# Altium schematic sheet MCU.SchDoc
size A4; SheetNumber: 2; SheetTotal: 3
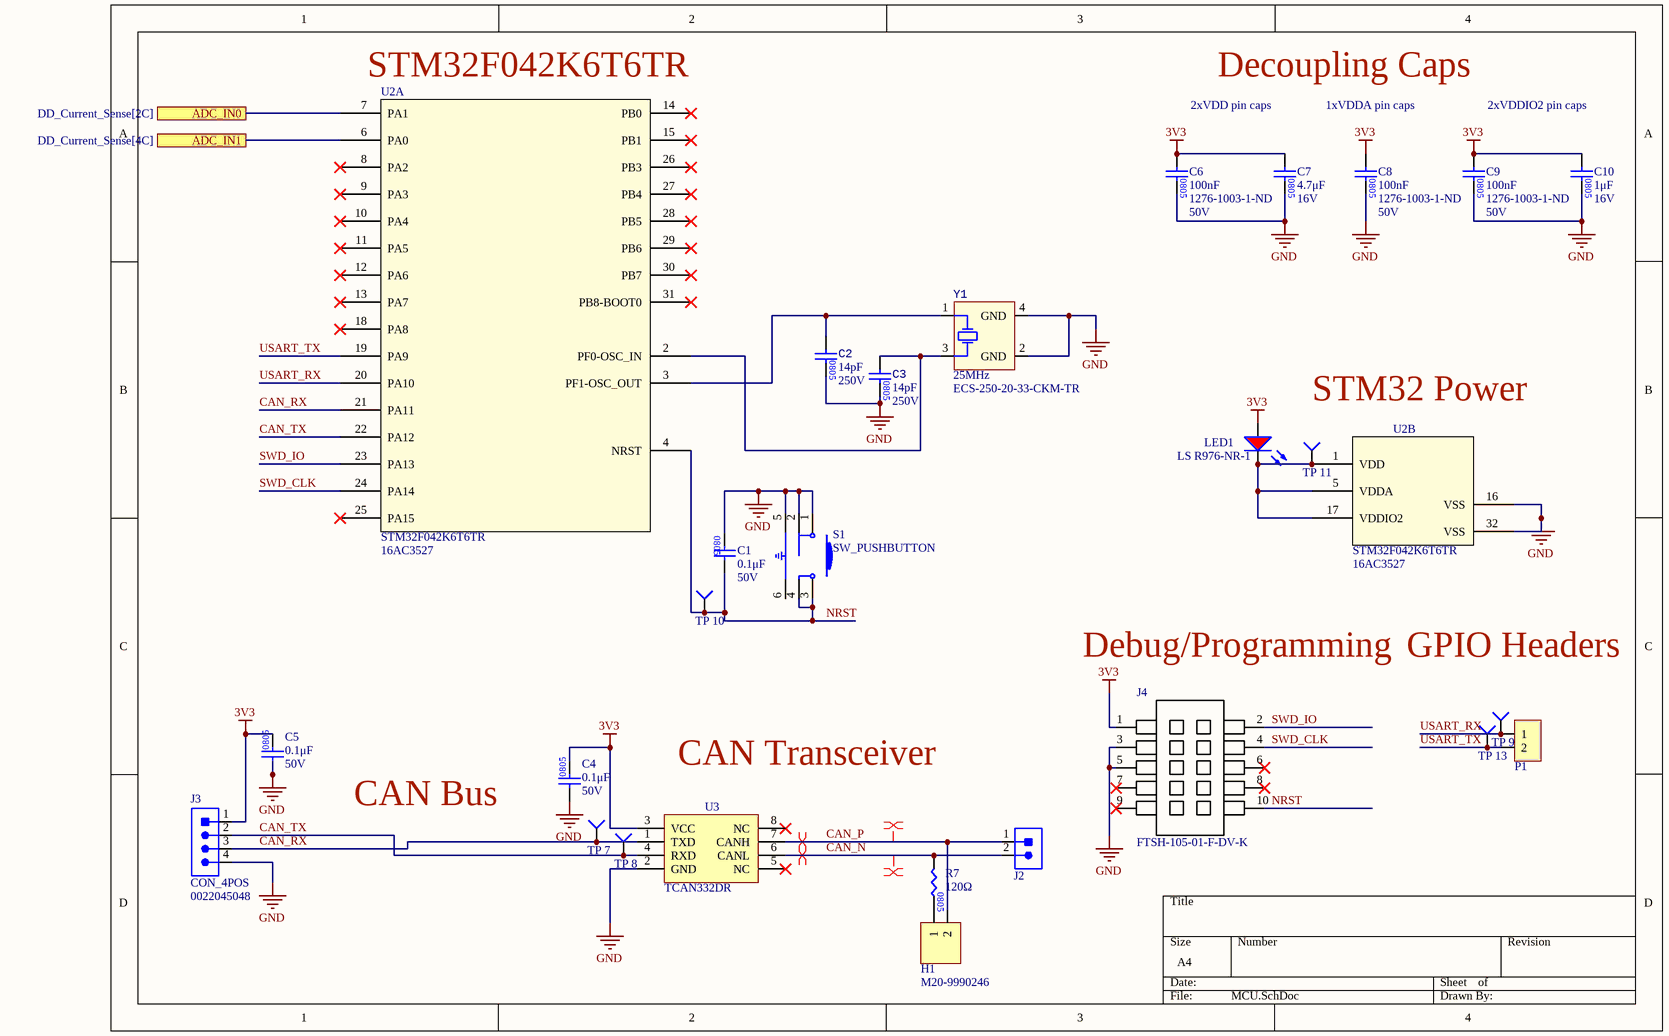
[diagram p0: MCU.SchDoc]

## Parts
C1  value 0.1μF  Voltage Rating: 50V  [CAP2012]  (hidden comment: CAP_0.1uF_50V_0805)
C2  value 14pF  Voltage Rating: 250V  [CAP0805]  (hidden comment: CAP_14pF_50V_0805)
C3  value 14pF  Voltage Rating: 250V  [CAP0805]  (hidden comment: CAP_14pF_50V_0805)
C4  value 0.1μF  Voltage Rating: 50V  [CAP0805]  (hidden comment: CAP_0.1uF_50V_0805)
C5  value 0.1μF  Voltage Rating: 50V  [CAP0805]  (hidden comment: CAP_0.1uF_50V_0805)
C6  value 100nF  Supplier Part Number 1: 1276-1003-1-ND  Voltage Rating: 50V  [CAP0805]  (hidden comment: CAP_100nF_50V_0805)
C7  value 4.7μF  Voltage Rating: 16V  [CAP0805]  (hidden comment: CAP_4.7uF_16V_0805)
C8  value 100nF  Supplier Part Number 1: 1276-1003-1-ND  Voltage Rating: 50V  [CAP0805]  (hidden comment: CAP_100nF_50V_0805)
C9  value 100nF  Supplier Part Number 1: 1276-1003-1-ND  Voltage Rating: 50V  [CAP0805]  (hidden comment: CAP_100nF_50V_0805)
C10  value 1μF  Voltage Rating: 16V  [CAP0805]  (hidden comment: CAP_1uF_16V_0805)
H1  Manufacturer Part Number 1: M20-9990246  [HDR1X2]  (hidden comment: HEADER)
J2  CON_2POS_SCREW_TERM  [1935161]  (value not drawn)
J3  CON_4POS  Manufacturer Part Number: 0022045048
J4  Manufacturer Part Number 1: FTSH-105-01-F-DV-K  [FTSH-105-01-F-DV-K-P-TR]  (hidden comment: CON_PROGRAMMING)
LED1  Manufacturer Part Number 1: LS R976-NR-1  [LED_0805_RED]  (hidden comment: LED_RED)
P1  CONN_TERMINAL_2  [OSTYK51102030]  (value not drawn)
R7  value 120Ω  [RES0805]  (hidden comment: RES_120Ω_0805_1%)
S1  SW_PUSHBUTTON  [TACTILE_SWITCH_SMD]
TP_7  TESTPOINT_1MM_CIRCLE  [TESTPOINT_CIRCLE_1MM]  (value not drawn)  (no BOM)
TP_8  TESTPOINT_1MM_CIRCLE  [TESTPOINT_CIRCLE_1MM]  (value not drawn)  (no BOM)
TP_9  TESTPOINT_1MM_CIRCLE  [TESTPOINT_CIRCLE_1MM]  (value not drawn)  (no BOM)
TP_10  TESTPOINT_1MM_CIRCLE  [TESTPOINT_CIRCLE_1MM]  (value not drawn)  (no BOM)
TP_11  TESTPOINT_1MM_CIRCLE  [TESTPOINT_CIRCLE_1MM]  (value not drawn)  (no BOM)
TP_13  TESTPOINT_1MM_CIRCLE  [TESTPOINT_CIRCLE_1MM]  (value not drawn)  (no BOM)
U2  STM32F042K6T6TR  Supplier Part Number 1: 16AC3527  [LQFP-32]  (parts A,B of 2)
U3  TCAN332DR  [SOIC127P599X175-8N]
Y1  Frequency: 25MHz  Manufacturer Part Number 1: ECS-250-20-33-CKM-TR  [XTAL_ECS-250-20-33-CKM-TR]  (hidden comment: CRYSTAL_25MHZ_20PF)

## Ports
ADC_IN0 (see DD_Current_Sense[2C]), ADC_IN1 (see DD_Current_Sense[4C])

## Nets
3V3: C4.2 C5.2 C6.1 C7.1 C8.1 C9.1 C10.1 J3.1 J4.1 LED1.1(A) U3.3(VCC)
GND: C1.1 C2.2 C3.2 C4.1 C5.1 C6.2 C7.2 C8.2 C9.2 C10.2 J3.4 J4.3 J4.5 S1.1 S1.2 S1.5 U2.16(VSS) U2.32(VSS) U3.2(GND) Y1.2(GND) Y1.4(GND)
ADC_IN0: U2.7(PA1) ; port ADC_IN0
ADC_IN1: U2.6(PA0) ; port ADC_IN1
CAN_N: J2.2 R7.1 U3.6(CANL)
CAN_P: H1.2 J2.1 U3.7(CANH)
CAN_RX: J3.3 TP_7.1(=value) U2.21(PA11) U3.1(TXD)
CAN_TX: J3.2 TP_8.1(=value) U2.22(PA12) U3.4(RXD)
NRST: C1.2 J4.10 S1.3 S1.4 TP_10.1(=value) U2.4(NRST)
SWD_CLK: J4.4 U2.24(PA14)
SWD_IO: J4.2 U2.23(PA13)
USART_RX: P1.1 TP_9.1(=value) U2.20(PA10)
USART_TX: P1.2 TP_13.1(=value) U2.19(PA9)
NetC2_1: C2.1 U2.3(PF1-OSC_OUT) Y1.1(HOT)
NetC3_1: C3.1 U2.2(PF0-OSC_IN) Y1.3(HOT)
NetH1_1: H1.1 R7.2
NetLED1_2: LED1.2(K) TP_11.1(=value) U2.1(VDD) U2.5(VDDA) U2.17(VDDIO2)

Not connected (* = marked no-connect by the designer): J4 6* 7* 8* 9*; S1 6; U2 8(PA2)* 9(PA3)* 10(PA4)* 11(PA5)* 12(PA6)* 13(PA7)* 14(PB0)* 15(PB1)* 18(PA8)* 25(PA15)* 26(PB3)* 27(PB4)* 28(PB5)* 29(PB6)* 30(PB7)* 31(PB8-BOOT0)*; U3 5(NC)* 8(NC)*

## Layout directives
differential pair: CAN_N, CAN_P

## Notes on the sheet
- (near U2) STM32F042K6T6TR
- 2xVDD pin caps
- Decoupling Caps
- 1xVDDA pin caps
- 2xVDDIO2 pin caps
- STM32 Power
- Debug/Programming
- GPIO Headers
- CAN Transceiver
- CAN Bus

## Library data of the parts
C1 = CAP_0.1uF_50V_0805: CAP CER 0.1UF 50V X7R 0805; Manufacturer Part Number 1: GCM21BR71H104KA37K; Manufacturer 1: Murata Electronics; Package/Footprint: 0805; Supplier Part Number 1: 490-8049-1-ND; Supplier 1: Digi-Key; Dielectric: X7R; LCSC Part #: C49678; Mounting Type: SMD
C2 C3 = CAP_14pF_50V_0805: CERAMIC CAP MLCC HIGH-Q 125C; Manufacturer: Murata Electronics; Manufacturer Part Number: GQM2195C2E140JB12D; Mounting Type: SMD; Package: 0805; Supplier 1: Digi-Key; Supplier Part Number 1: 490-GQM2195C2E140JB12DCT-ND
C4 C5 = CAP_0.1uF_50V_0805: CAP CER 0.1UF 50V X7R 0805; Manufacturer 1: Murata Electronics; Manufacturer Part Number 1: GCM21BR71H104KA37K; Package/Footprint: 0805; Mounting Type: SMD; Supplier 1: Digi-Key; Supplier Part Number 1: 490-8049-1-ND; Dielectric: X7R; LCSC Part #: C49678
C6 C8 C9 = CAP_100nF_50V_0805: CAP CER 0.1UF 50V X7R 0805; Manufacturer 1: Samsung Electro-Mechanics; Manufacturer Part Number 1: CL21B104KBCNNNC; Package/Footprint: 0805; Supplier 1: Digi-Key
C7 = CAP_4.7uF_16V_0805: CAP CER 4.7UF 16V X5R 0805; Manufacturer 1: Samsung Electro-Mechanics; Manufacturer Part Number 1: CL21A475KOFNNNE; Mounting Type: SMD; Supplier 1: Digi-Key; Supplier Part Number 1: 1276-1065-1-ND; Package: 0805; LCSC Part #: C1779; Dielectric: X5R
C10 = CAP_1uF_16V_0805: CAP CER 1UF 16V X7R 0805; Manufacturer 1: Yageo; Manufacturer Part Number 1: CC0805KKX7R7BB105; Mounting Type: SMD; Supplier 1: Digi-Key; Supplier Part Number 1: 311-1365-1-ND; Package: 0805; Dielectric: X7R
H1 = HEADER: HEADER 2X1; Manufacturer 1: Harwin Inc.; Package/Footprint: TH; Mounting Type: TH; Supplier 1: Digi-Key; Supplier Part Number 1: 952-2262-ND
J2 = CON_2POS_SCREW_TERM: TERM BLK 2POS SIDE ENTRY 5MM; Manufacturer 1: Phoenix Contact; Package/Footprint: SMD; Supplier 1: Digi-Key; Mounting Type: TH; Supplier Part Number 1: 277-1667-ND; Manufacturer Part Number 1: 1935161
J3 = CON_4POS: CONN HEADER VERT 4POS 2.54MM; Manufacturer: Molex; Supplier 1: Digi-Key; Supplier Part Number 1: 0022045048-ND; RoHS: Yes; Category: Headers and Wire Housings; Pricing 1: 16000=0.12858 (USD); ComponentLink1URL: https://datasheet.ciiva.com/6839/022045032-sd-6839882.pdf?src-supplier=Digi-Key; ComponentLink1Description: https://datasheet.ciiva.com/6839/022045032-sd-6839882.pdf?src-supplier=Digi-Key
J4 = CON_PROGRAMMING: CONN HEADER SMD 10POS 1.27MM; Manufacturer 1: Samtec; Supplier 1: Digi-Key; Pitch: 1.27mm; Supplier Part Number 1: SAM8796-ND; Mounting Type: SMD
LED1 = LED_RED: LED RED DIFFUSED 0805 SMD; Manufacturer 1: OSRAM; Package/Footprint: 0805; Forward Voltage Drop: 2V; Forward Current: 20mA; Supplier Part Number 1: 475-1278-1-ND; Supplier 1: Digi-Key; Mounting Type: SMD
P1 = CONN_TERMINAL_2: Header, 2-Pin; Manufacturer 1: On Shore Technology Inc.; Manufacturer Part Number 1: OSTYK51102030; Supplier Part Number 1: ED2953-ND; Supplier 1: Digi-Key
R7 = RES_120Ω_0805_1%: RES 120 OHM 1% 1/8W 0805; Manufacturer 1: Vishay; Manufacturer Part Number 1: CRCW0805120RFKEA; Package/Footprint: 0805; Supplier 1: Digi-Key; Mounting Type: SMD; Supplier Part Number 1: 541-120CCT-ND; LCSC Part #: C17437
S1 = SW_PUSHBUTTON: SMT 3.0 X 2.6 MM TACT SWITCH WIT; Manufacturer 1: Würth Elektronik; Manufacturer Part Number 1: 435151014824; Supplier 1: Digi-Key; Supplier Part Number 1: 732-435151014824CT-ND
TP_7-TP_11 TP_13 = TESTPOINT_1MM_CIRCLE: TESTPOINT 1MM CIRCLE
U2 = STM32F042K6T6TR: ARM® Cortex®-M0 STM32F0 Microcontroller IC 32-Bit Single-Core 48MHz 32KB (32K x 8) FLASH 32-LQFP (7x7); Mfr_Name: STMicroelectronics; Voltage - Supply (Vcc/Vdd): 2V ~ 3.6V; Core Processor: ARM® Cortex®-M0; Core Size: 32-Bit Single-Core; Speed: 48MHz; Program Memory Size: 32KB (32K x 8); Operating Temperature: -40°C ~ 85°C (TA); Package / Case: 32-LQFP; ComponentLink1Description: digikey; ComponentLink1URL: https://www.digikey.com/en/products/detail/stmicroelectronics/STM32F042K6T6TR/10414582; Supplier 1: Avnet
U3 = TCAN332DR: IC CAN TRANSCEIVER; Manufacturer 1: Texas Instruments; Manufacturer Part Number 1: TCAN332DR; Supplier 1: Digi-Key; Supplier Part Number 1: 296-43711-1-ND
Y1 = CRYSTAL_25MHZ_20PF: CRYSTAL 25.0000MHZ 20PF SMD; Manufacturer 1: ECS Inc.; Load Capacitance: 20pF; Supplier 1: Digi-Key; Supplier Part Number 1: XC1817CT-ND; Mounting Type: SMD; Package/Footprint: SMD